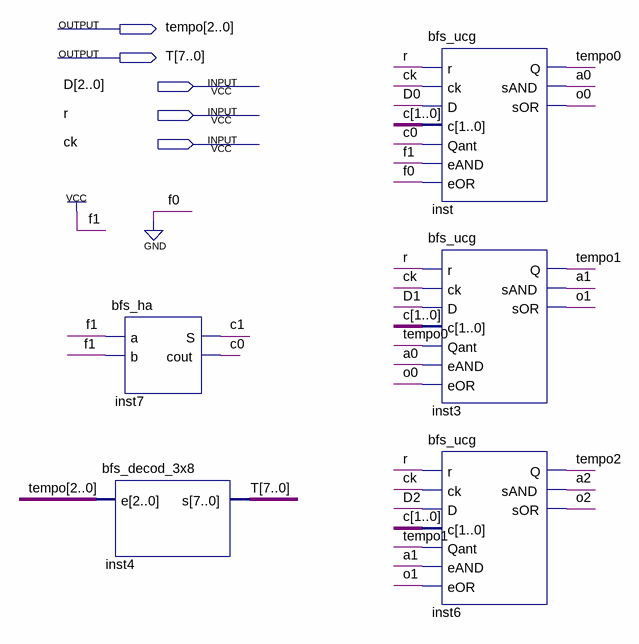
[diagram p0: schematic sheet]
// Quartus schematic bfs_temporizador.bdf as structural Verilog: 5 symbols, 5 pins
module bfs_temporizador (
  input  [2:0] D,
  input  r,
  input  ck,
  output [2:0] tempo,
  output [7:0] T
);

  wire a0, a1, a2, o0, o1, o2;
  wire [1:0] c;

  bfs_ha inst7 (.a(1'b1), .b(1'b1), .S(c[1]), .cout(c[0]));
  bfs_decod_3x8 inst4 (.e(tempo), .s(T));
  bfs_ucg inst (
    .r(r), .ck(ck), .D(D[0]), .c(c), .Qant(c[0]), .eAND(1'b1), .eOR(1'b0), .Q(tempo[0]), .sAND(a0), .sOR(o0));
  bfs_ucg inst3 (
    .r(r), .ck(ck), .D(D[1]), .c(c), .Qant(tempo[0]), .eAND(a0), .eOR(o0), .Q(tempo[1]), .sAND(a1), .sOR(o1));
  bfs_ucg inst6 (
    .r(r), .ck(ck), .D(D[2]), .c(c), .Qant(tempo[1]), .eAND(a1), .eOR(o1), .Q(tempo[2]), .sAND(a2), .sOR(o2));
endmodule
